# EAGLE design v0 (EAGLE 8.5.2)
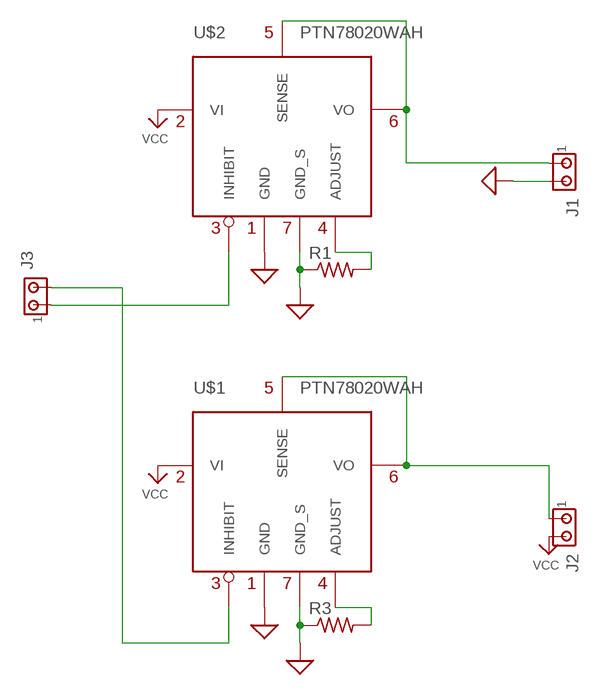
[diagram p0: schematic, sheet 1]

## Parts
J1  MTA02-156  [MYJUMPER]
J2  MTA02-156  [MYJUMPER]
J3  MTA02-156  [MYJUMPER]
R1  FLIPFLOP-RES  [0805-THM]
R3  FLIPFLOP-RES  [0805-THM]
U$1  PTN78020WAH  [PTN78020WAH]
U$2  PTN78020WAH  [PTN78020WAH]

## Nets
GND: J1.2 R1.1 R3.1 U$1.1(GND) U$1.7(GND_S) U$2.1(GND) U$2.7(GND_S) ; supply symbol labelled SUP
N$1: R1.2 U$2.4(ADJUST)
N$2: J2.1 U$1.5(SENSE) U$1.6(VO)
N$3: J3.1 U$2.3(INHIBIT)
N$4: J1.1 U$2.5(SENSE) U$2.6(VO)
N$6: R3.2 U$1.4(ADJUST)
N$11: J3.2 U$1.3(INHIBIT)
VCC: J2.2 U$1.2(VI) U$2.2(VI)

## Library data of the parts
J1-J3 = 1x2mta:MTA02-156: AMP connector
R1 R3 = adafruit:FLIPFLOP-RES: Flip Flop resistor An 0805 resistor inside a standard 1/4W 5% resistor. Makes for easy mods
U$1 U$2 = ptn78060wah:PTN78020WAH

## Board
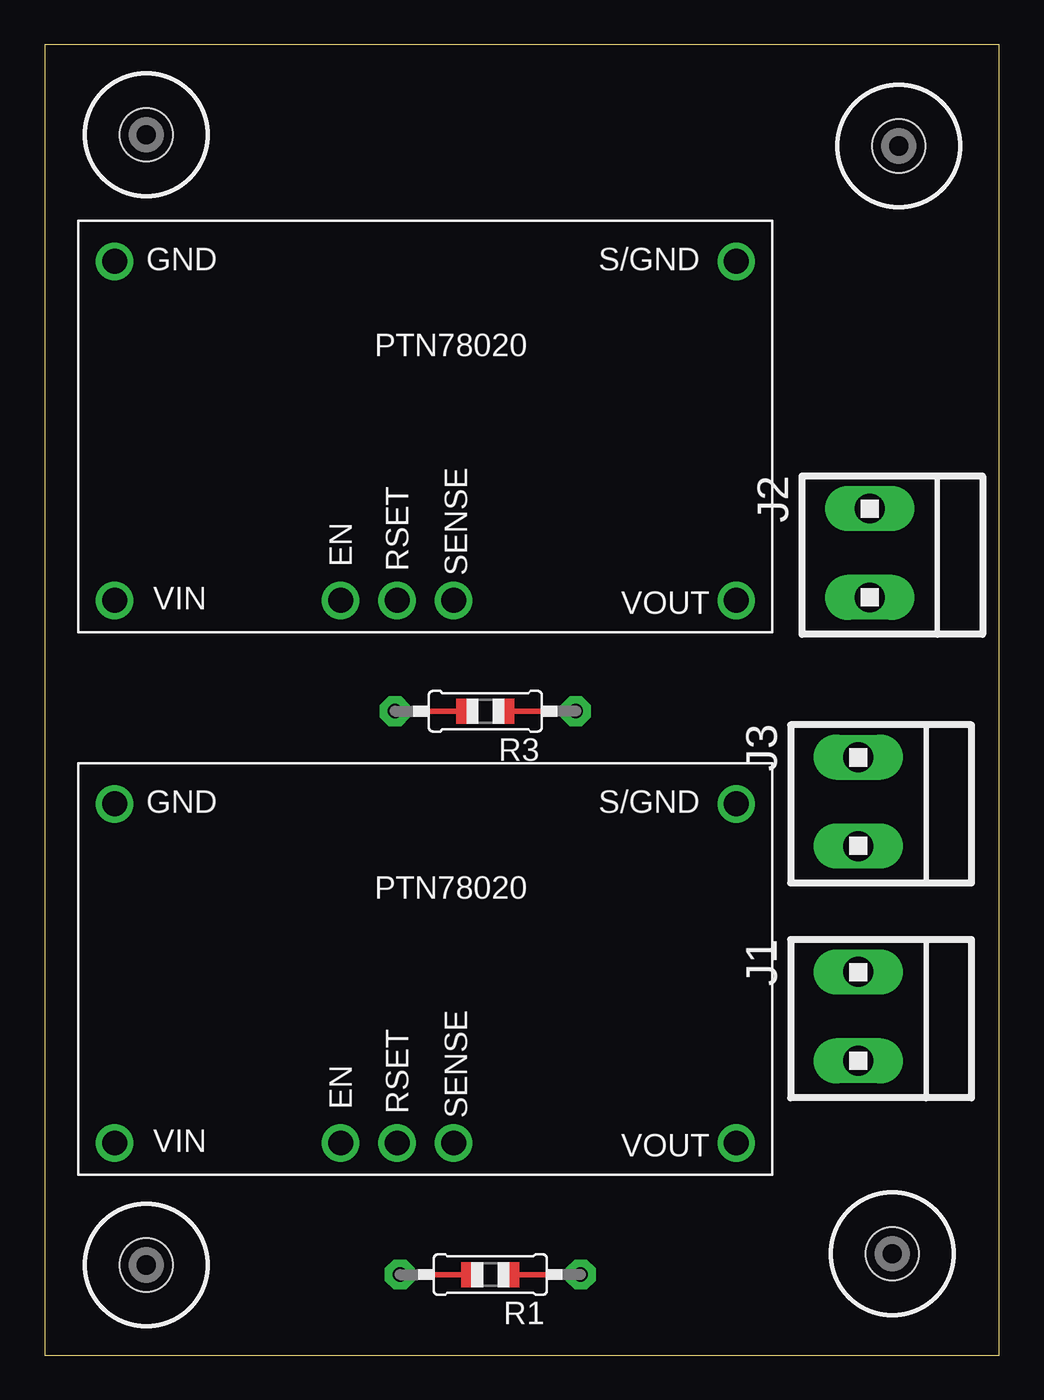
[diagram p1: board, top side]
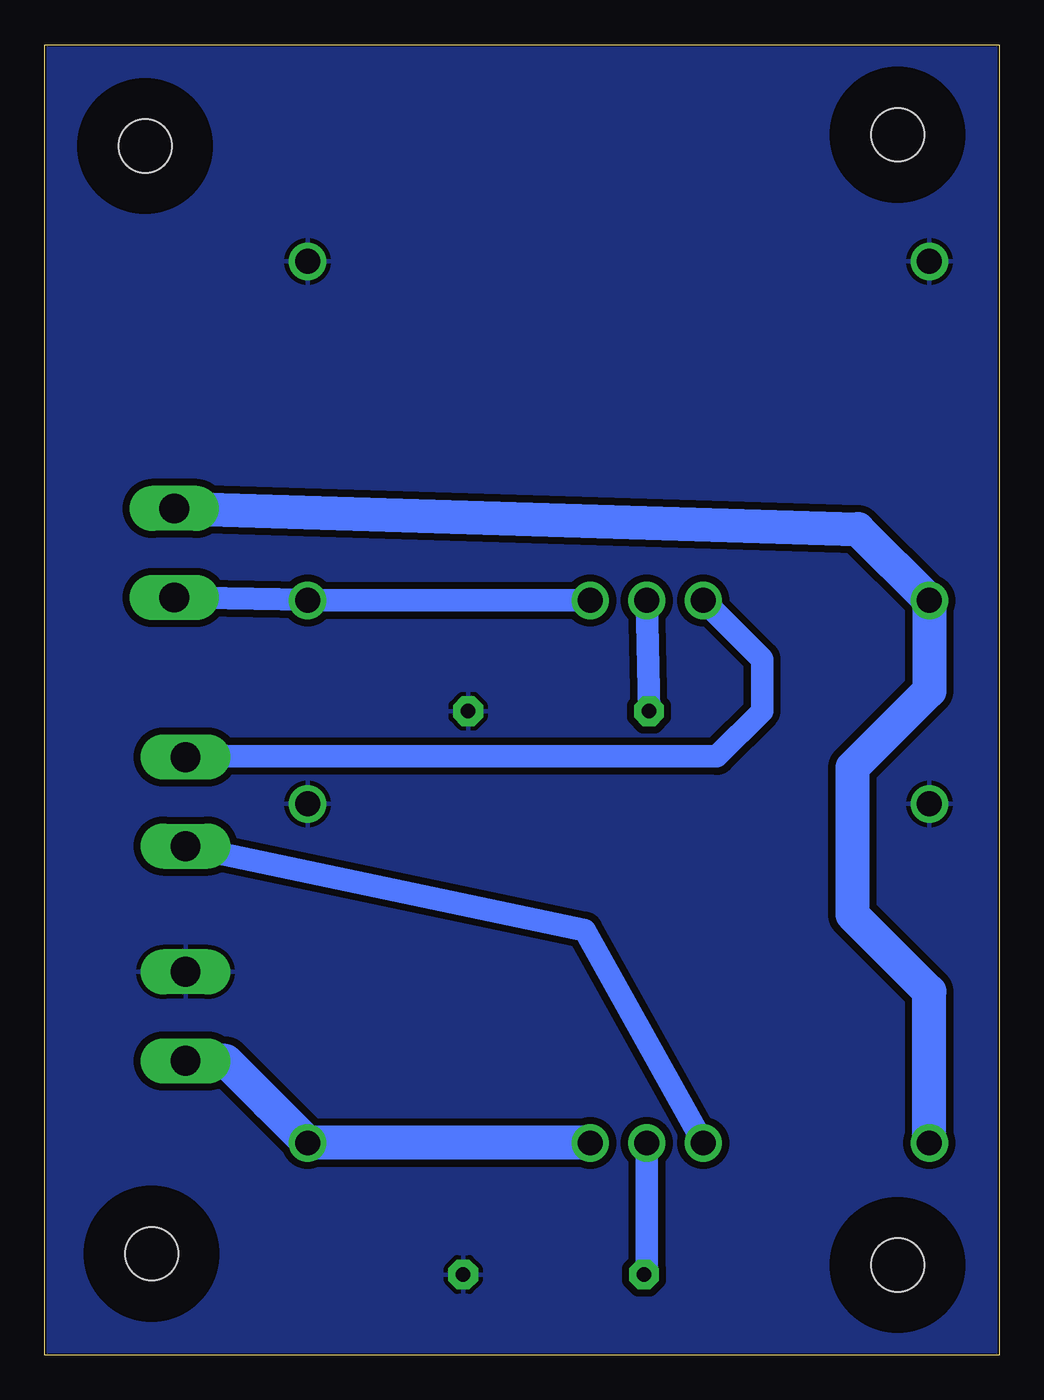
[diagram p2: board, bottom side, seen from below]

Size 53.65 x 73.65 mm. Coordinates in mm from the lower left corner, seen from the top.
Outline: 0,0 53.65,0 53.65,73.65 0,73.65 0,0
Copper layers (1*16): Top 0.035mm / dielectric 1.5mm / Bottom 0.035mm
Design rules "default *": minimum track width 6mil, minimum drill 0.35mm, track to track 16mil, track to pad 6mil, pad to pad 6mil, via to via 6mil, smd to smd 6mil, copper to edge 4mil, drill to drill 6mil, minimum pad ring 10mil, minimum via ring 8mil, stop-mask expansion 4mil, vias tented up to drill 0mil, thermal gap 10mil

### Footprints (pad centres in the part's own frame; a part is rotated, then mirrored left to right if it is on the bottom)
MYJUMPER = drill 1.676 long: 1 2.5,0; 2 -2.5,0
0805-THM = drill 0.813 pad 1.676 octagon: 1 -5.08,0; 2 5.08,0
PTN78020WAH = drill 1.4: 1 2.032,20.828; 2 2.032,1.778; 3 14.732,1.778; 4 17.907,1.778; 5 21.082,1.778; 6 36.957,1.778; 7 36.957,20.828
DRIL-3 = hole 3: 0,0

### Placement (x,y rotation side)
J1  45.72,19.05 270 top
J2  46.36,45.09 270 top
J3  45.72,31.12 270 top
R1  25.04,4.55 180 top
R3  24.76,36.2 180 top
U$1  1.91,40.64 0 top
U$2  1.91,10.16 0 top
U$3  [DRIL-3]  5.71,68.58 0 top
U$4  [DRIL-3]  47.99,67.95 0 top
U$5  [DRIL-3]  47.62,5.71 90 top
U$6  [DRIL-3]  5.71,5.08 90 top

### Tracks (layer width: path | path; a pad name or v marks a point on that pad's centre or on a via)
GND
  pour Bottom: 0,73.66 53.98,73.66 53.75,0.08 0,0.1
N$1
  Bottom 1.27: U$2.4 19.81,4.7 R1.2
N$2
  Bottom 1.27: J2.1 38.91,42.47 U$1.6 U$1.5
N$3
  Bottom 1.27: U$2.3 23.3,23.9 J3.1
N$4
  Bottom 1.905: U$2.5 U$2.6 41.08,14.16 43.47,16.55 J1.1
N$6
  Bottom 1.27: R3.2 U$1.4
N$11
  Bottom 0.152: 45.68,33.66 J3.2
  Bottom 1.27: U$1.3 13.34,39.12 13.34,36.2 15.88,33.66 45.68,33.66
VCC
  Bottom 1.905: U$2.2 3.94,20.45 8.26,24.77 8.26,33.02 3.94,37.34 U$1.2 7.95,46.43 J2.2

### Text on the board
bDocu: PTN78020 - Robotech V0 / 5V / 10V | VCC / VOUT 1 / EN 1 / EN2 / GND / VOUT2